# Altium project RF_REVE.PrjPcb
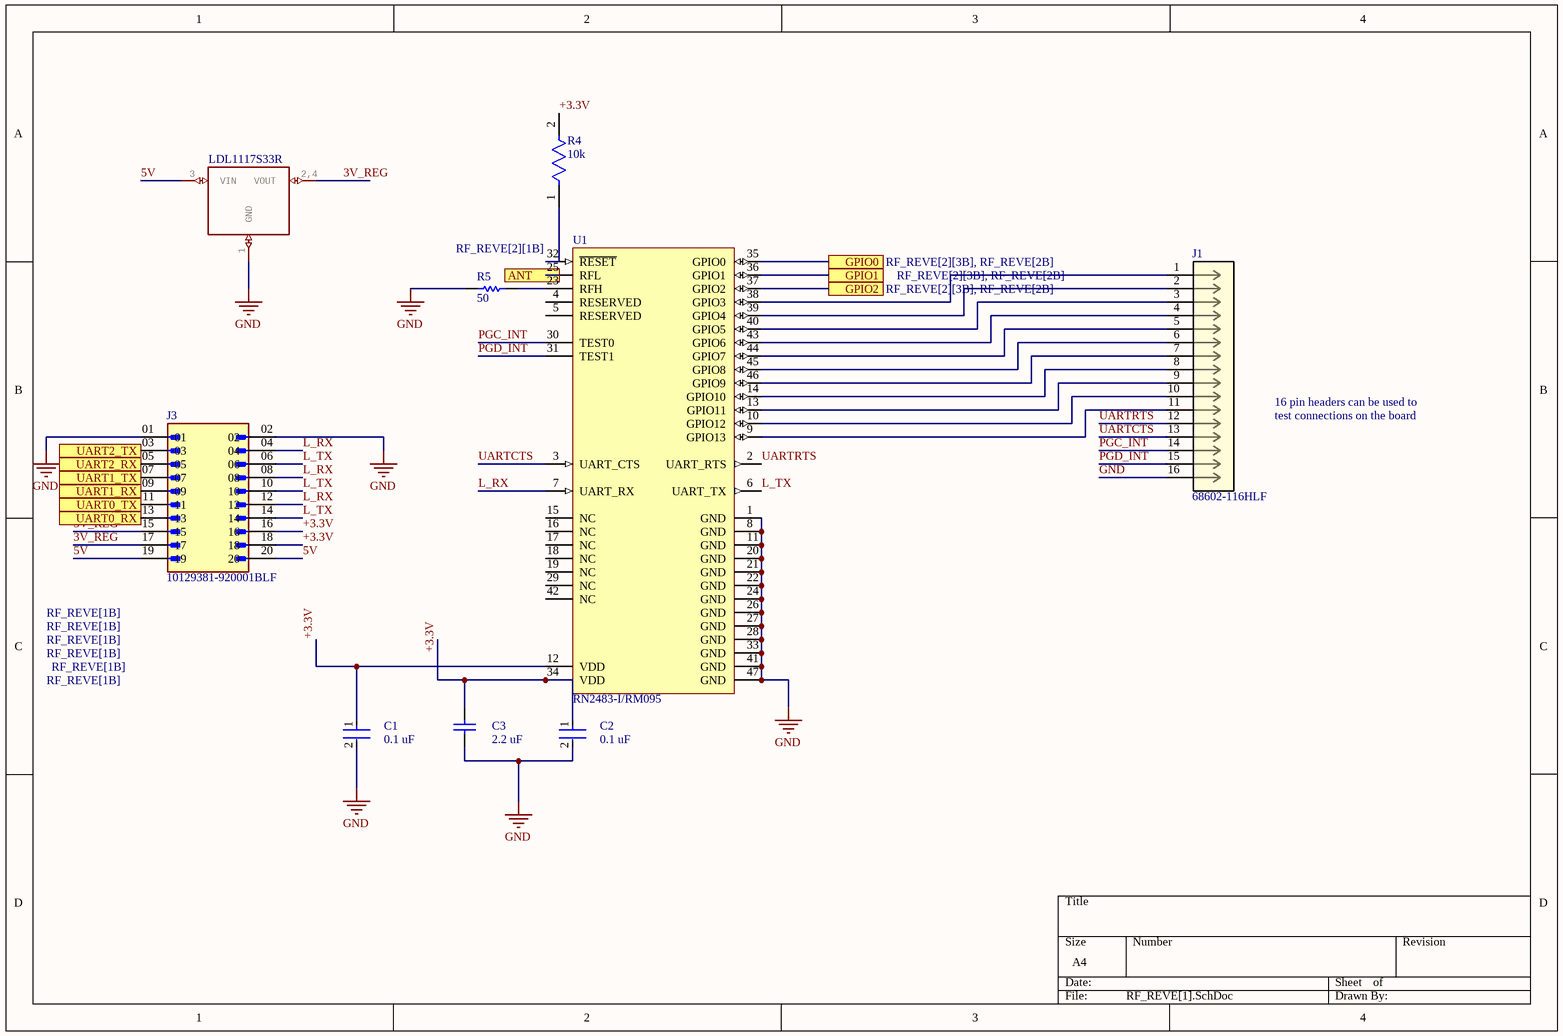
[diagram p0: RF_REVE[1].SchDoc]
2 sheets, 16 parts. Net scope: flat (ports and power ports of the same name join across sheets).
Board file: RF_REVE.PcbDoc
Sheets:
  RF_REVE[1].SchDoc
  RF_REVE[2].SchDoc

## Sheet RF_REVE[1].SchDoc
size A4; SheetNumber: 1; SheetTotal: 3

### Parts
C1  0.1 uF  [FP-C0805C-DN-MFG]
C2  0.1 uF  [FP-C0805C-DN-MFG]
C3  2.2 uF  [CAPC2013X145X50ML20T25]
J1  68602-116HLF  [CONN_68602-116HLF_AMP]
J3  10129381-920001BLF  [AMPHENOL_10129381-920001BLF]
R4  10k  [FP-MC01W0805-IPC_C]
R5  50  [RESC2013X60X35ML10T20]
U1  RN2483-I/RM095  [MCHP-RN2483-47_V]
U2  LDL1117S33R  [FP-SOT223-0046067-IPC_B]

### Ports
ANT (see RF_REVE[2][1B]), GPIO0 (see RF_REVE[2][3B], RF_REVE[2B]), GPIO1 (see RF_REVE[2][3B], RF_REVE[2B]), GPIO2 (see RF_REVE[2][3B], RF_REVE[2B]), UART0_RX (see RF_REVE[1B]), UART0_TX (see RF_REVE[1B]), UART1_RX (see RF_REVE[1B]), UART1_TX (see RF_REVE[1B]), UART2_RX (see RF_REVE[1B]), UART2_TX (see RF_REVE[1B])

### Nets
GND: C1.2 C2.2 C3.1 J1.16 J3.01 J3.02 R5.1 U1.1(GND) U1.8(GND) U1.11(GND) U1.20(GND) U1.21(GND) U1.22(GND) U1.24(GND) U1.26(GND) U1.27(GND) U1.28(GND) U1.33(GND) U1.41(GND) U1.47(GND) U2.1(GND)
3V_REG: J3.15 J3.17 U2.2,4(VOUT)
5V: J3.19 J3.20 U2.3(VIN)
+3.3V: C1.1 C2.1 C3.2 J3.16 J3.18 R4.2 U1.12(VDD) U1.34(VDD)
ANT: U1.25(RFL) ; port ANT
GPIO0: U1.35(GPIO0) ; port GPIO0
GPIO1: U1.36(GPIO1) ; port GPIO1
GPIO2: U1.37(GPIO2) ; port GPIO2
L_RX: J3.04 J3.08 J3.12 U1.7(UART_RX)
L_TX: J3.06 J3.10 J3.14 U1.6(UART_TX)
PGC_INT: J1.14 U1.30(TEST0)
PGD_INT: J1.15 U1.31(TEST1)
UART0_RX: J3.13 ; port UART0_RX
UART0_TX: J3.11 ; port UART0_TX
UART1_RX: J3.09 ; port UART1_RX
UART1_TX: J3.07 ; port UART1_TX
UART2_RX: J3.05 ; port UART2_RX
UART2_TX: J3.03 ; port UART2_TX
UARTCTS: J1.13 U1.3(UART_CTS)
UARTRTS: J1.12 U1.2(UART_RTS)
NetJ1_1: J1.1 U1.38(GPIO3)
NetJ1_2: J1.2 U1.39(GPIO4)
NetJ1_3: J1.3 U1.40(GPIO5)
NetJ1_4: J1.4 U1.43(GPIO6)
NetJ1_5: J1.5 U1.44(GPIO7)
NetJ1_6: J1.6 U1.45(GPIO8)
NetJ1_7: J1.7 U1.46(GPIO9)
NetJ1_8: J1.8 U1.14(GPIO10)
NetJ1_9: J1.9 U1.13(GPIO11)
NetJ1_10: J1.10 U1.10(GPIO12)
NetJ1_11: J1.11 U1.9(GPIO13)
NetR4_1: R4.1 U1.32(~{RESET})
NetR5_2: R5.2 U1.23(RFH)

Not connected (* = marked no-connect by the designer): U1 4(RESERVED) 5(RESERVED) 15(NC) 16(NC) 17(NC) 18(NC) 19(NC) 29(NC) 42(NC)

### Notes on the sheet
- 16 pin headers can be used to
- test connections on the board

### Library data of the parts
C1 C2 = CMP-2007-00279-2: CAP CER 0.1UF 50V X7R 0805; Manufacturer Part Number: C0805C104K5RACTU; Manufacturer: KEMET; Value: 0.10 μF; Tolerance: 0.1; Temperature Coefficient: 30ppm/°C; Material: Ceramic; Device Class L2: Capacitors; Temperature Range Low: -55°C; Voltage Rating: 50 V; Digikey Description: CAP CER 0.1UF 50V X7R 0805; Category: Cap; ComponentLink2Description: Datasheet; Octopart: https://octopart.com/c0805c104k5ractu-kemet-143926; RoHS: TRUE; ComponentLink2URL: https://content.kemet.com/datasheets/KEM_C1003_C0G_SMD.pdf; Temperature Characteristic: X7R; Temperature: -55°C to +125°C; Height: 0.88mm; Temperature Range High: +125°C; Device Class L1: Passive Components; Automotive: No; Lead Free: Yes; Ipc Land Pattern Name: CAPC200125X78; Device Class L3: Ceramic Capacitors; Mouser Description: Cap Ceramic 0.1uF 50V X7R 10% SMD 2.0 x 1.2 mm 125 C Paper T/R; Capacitance: 0.10 μF; Package: C0805C-DN
C3 = CMP-2007-01011-1: Manufacturer: Kemet; Part Number: C0805C225K8PACTU
J1 = CMP-013-000001-2: No Description Available; Mfr_Name: Amphenol ICC; Copyright: Copyright (C) 2023 Ultra Librarian. All rights reserved.; Source: 68602-116HLF.SchLib; Digi-Key_Part_Number_1: 609-3364-ND; Design Item ID: 68602-116HLF; Manufacturer_Part_Number: 68602-116HLF; RefDes: RefDes; Type: DEV
J3 = CMP-009-000000-2: EconoStikâ„¢, Board to Board connector, Unshrouded Vertical Header, Through Hole, Double Row, 20 Positions, 2.54 mm (0.100in) Pitch.; MF: Amphenol ICC (FCI); MP: 10129381-920001BLF; SnapEDA_Link: https://www.snapeda.com/parts/10129381-920001BLF/Amphenol+FCI/view-part/?ref=snap; Purchase-URL: https://pricing.snapeda.com/search/part/10129381-920001BLF/?ref=eda; Design Item ID: 10129381-920001BLF; Value: *; Digi-Key_Part_Number: 10129381-920001BLF-ND; Package: None; Source: 10129381-920001BLF.SchLib; Pin Count: 20; Component Type: Standard; Check_prices: https://www.snapeda.com/parts/10129381-920001BLF/Amphenol+FCI/view-part/?ref=eda
R4 = CMP-12256-000003-1: Resistor, 10K, 0.1W, 1%, 0805, Reel; Resistance: 10kR; Voltage Rating: 150V; Temperature Coefficient: 100ppm/°C; Power Rating: 100mW; REACH SVHC: No SVHC; Composition: Thick Film; Max Operating Temperature: 155°C; Case/Package: 0805; Tolerance: 1%; Number of Pins: 2; Case Code (Metric): 2012; Voltage Rating (DC): 150V; Min Operating Temperature: -55°C; Width: 1.25mm; Case Code (Imperial): 0805; Packaging: Cut Tape
R5 = CMP-2001-04564-1: Part Number: RC0805FR-131K8L; Manufacturer: Yageo
U1 = CMP-2000-05219-1: Low-Power Long Range LoRa(TM) Technology Transceiver Module, 2.1 to 3.6 V, -40 to 85 degC, 47-Pin SMD, RoHS; Manufacturer: Microchip; Minimum Operating Supply Voltage: 2.1V; Maximum Operating Supply Voltage: 3.6V; Operating Band Frequency Range: 438,868MHz; Datasheet Version: Rev. A, 03/2015; Dimensions: 17.8x26.7x3mm; Operating Supply Voltage Range: 2.1to3.6V; Package Type: Module; Mounting Type: SurfaceMount; Manufacturer URL: http://www.microchip.com/; Length: 26.7mm; Minimum Operating Temperature: -40degC; Operating Temperature Range: -40to+85degC; Datasheet URL: http://datasheet.octopart.com/RN2483-I-RM095-Microchip-datasheet-44892142.pdf; Pin Count: 47; Width: 17.8mm; Maximum Operating Temperature: +85degC; Height: 3mm
U2 = CMP-006-000017-2: 1.2AHIGHPSRRLOWDROPOUTLINE; pin to pad: 2,4>2+4; Min Input Voltage: 2.5V; GateName_1: G$1; Min Output Voltage: 3.3V; Output Configuration: Positive; Dropout Voltage: 350mV; Number of Outputs: 1; Power Supply Rejection Ratio (PSRR): 65dB; Quiescent Current: 250uA; Output Current: 1.2A; Output Type: Fixed; Max Supply Voltage: 18V; Source: MCU Board.SCHLIB; Case/Package: SOT-223-4; Package: SOT223; Pin Count: 3; Weight: 0.009171oz; SymbolName_1: LDL1117; RoHS Compliant: Yes; Min Operating Temperature: -40°C; Mounting Technology: Surface Mount; LibraryName: MCU Board; Package Quantity: 2500; Packaging: Tape and Reel; Component Type: Standard; Output Voltage: 3.3V; Max Operating Temperature: 125°C; Series: LDL1117; Design Item ID: LDL1117S33R; DeviceSetName: LDL1117S33R; Number of Regulators: 1

## Sheet RF_REVE[2].SchDoc
size A4; SheetNumber: 3; SheetTotal: 3
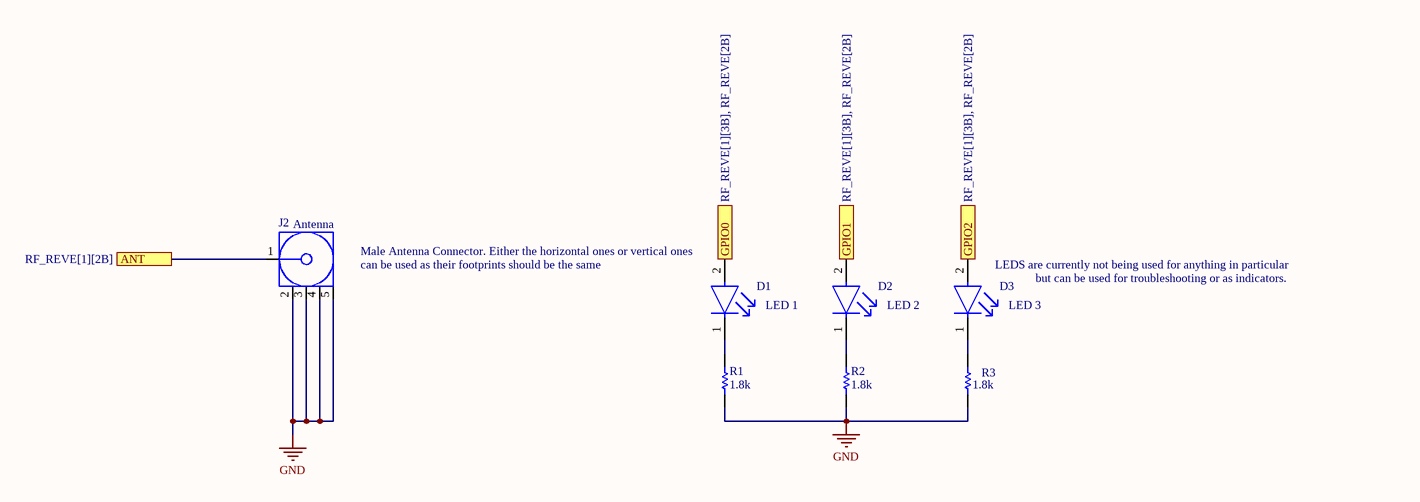
[diagram p1: RF_REVE[2].SchDoc]

### Parts
D1  LED 1  [FP-APTD3216CGCK-MFG]
D2  LED 2  [FP-APTD3216CGCK-MFG]
D3  LED 3  [FP-APTD3216CGCK-MFG]
J2  Antenna  [CINC-142-0701-801_V]
R1  1.8k  [RESC2013X60X35ML10T20]
R2  1.8k  [RESC2013X60X35ML10T20]
R3  1.8k  [RESC2013X60X35ML10T20]

### Ports
ANT (see RF_REVE[1][2B]), GPIO0 (see RF_REVE[1][3B], RF_REVE[2B]), GPIO1 (see RF_REVE[1][3B], RF_REVE[2B]), GPIO2 (see RF_REVE[1][3B], RF_REVE[2B])

### Nets
GND: J2.2 J2.3 J2.4 J2.5 R1.1 R2.1 R3.1
ANT: J2.1 ; port ANT
GPIO0: D1.2(A) ; port GPIO0
GPIO1: D2.2(A) ; port GPIO1
GPIO2: D3.2(A) ; port GPIO2
NetD1_1: D1.1(C) R1.2
NetD2_1: D2.1(C) R2.2
NetD3_1: D3.1(C) R3.2

### Notes on the sheet
- Male Antenna Connector. Either the horizontal ones or vertical ones
- (near J2) can be used as their footprints should be the same
- (near D3) LEDS are currently not being used for anything in particular
- but can be used for troubleshooting or as indicators.

### Library data of the parts
D1-D3 = CMP-2000-05792-2: LED GREEN CLEAR 2SMD; Forward Voltage: 2.1V; Forward Current: 20mA; Luminous Intensity: 300mcd; Number of LEDs: 1; Dominant Wavelength: 570nm; Viewing Angle: 50°; Lead Free: Lead Free; Lens Color: Clear; Mount: Surface Mount; Package Quantity: 2000; Height: 1.8mm; Number of Pins: 2; Test Current: 20mA; Case Code (Metric): 3216; Case/Package: 1206; Case Code (Imperial): 1206; Illumination Color: Green; Color: Green; Width: 1.6mm; Packaging: Tape and Reel; Min Operating Temperature: -40°C; Lens Style: Clear; Max Operating Temperature: 85°C; Length: 3.2mm
J2 = CMP-2000-05490-1: SMA End Launch Jack Receptacle, 50 Ohm, 0 to 18 GHz, -65 to 165 degC, 5-Pin SMD, RoHS, Bulk; Manufacturer: EmersonConnectivitySolutions; Connector Type: JackPCB; Gender: Jack(Female); Impedance: 50Ohms; Brand: Johnson/EmersonConnectivitySolutions; Body Material: Brass; Body Style: Straight; Maximum Frequency: 18GHz; Factory Pack Quantity: 5; Datasheet URL: https://belfuse.com/resources/Johnson/productinformation/pi-142-0701-801.pdf; Datasheet Version: 12/2014; Operating Temperature Range: -65Cto+165C; Mounting Technology: SurfaceMount; RF Series: SMA; Package Reference: 142-0701-801; Product Category: RFConnectors/CoaxialConnectors; Termination Style: Solder; RoHS: Details; Package URL: https://belfuse.com/resources/Johnson/drawings/dr-1420701801.pdf; Series: SMA; Package Description: 5-Pin Surface Mount Device, Body 14.275 x 9.525 mm; Manufacturer URL: http://www.cinch.com/; Contact Plating: Gold; Product: Connectors; Orientation: Straight
R1-R3 = CMP-2001-04564-1: as R5 on sheet RF_REVE[1]

## Nets that join several sheets
GND: RF_REVE[1] (21 pins), RF_REVE[2] (7 pins)
ANT: RF_REVE[1] (U1.25), RF_REVE[2] (J2.1)
GPIO0: RF_REVE[1] (U1.35), RF_REVE[2] (D1.2)
GPIO1: RF_REVE[1] (U1.36), RF_REVE[2] (D2.2)
GPIO2: RF_REVE[1] (U1.37), RF_REVE[2] (D3.2)